# EAGLE design Gadget-Box-atmega32u4 (EAGLE 6.6.0)

## Sheet 1 of 3
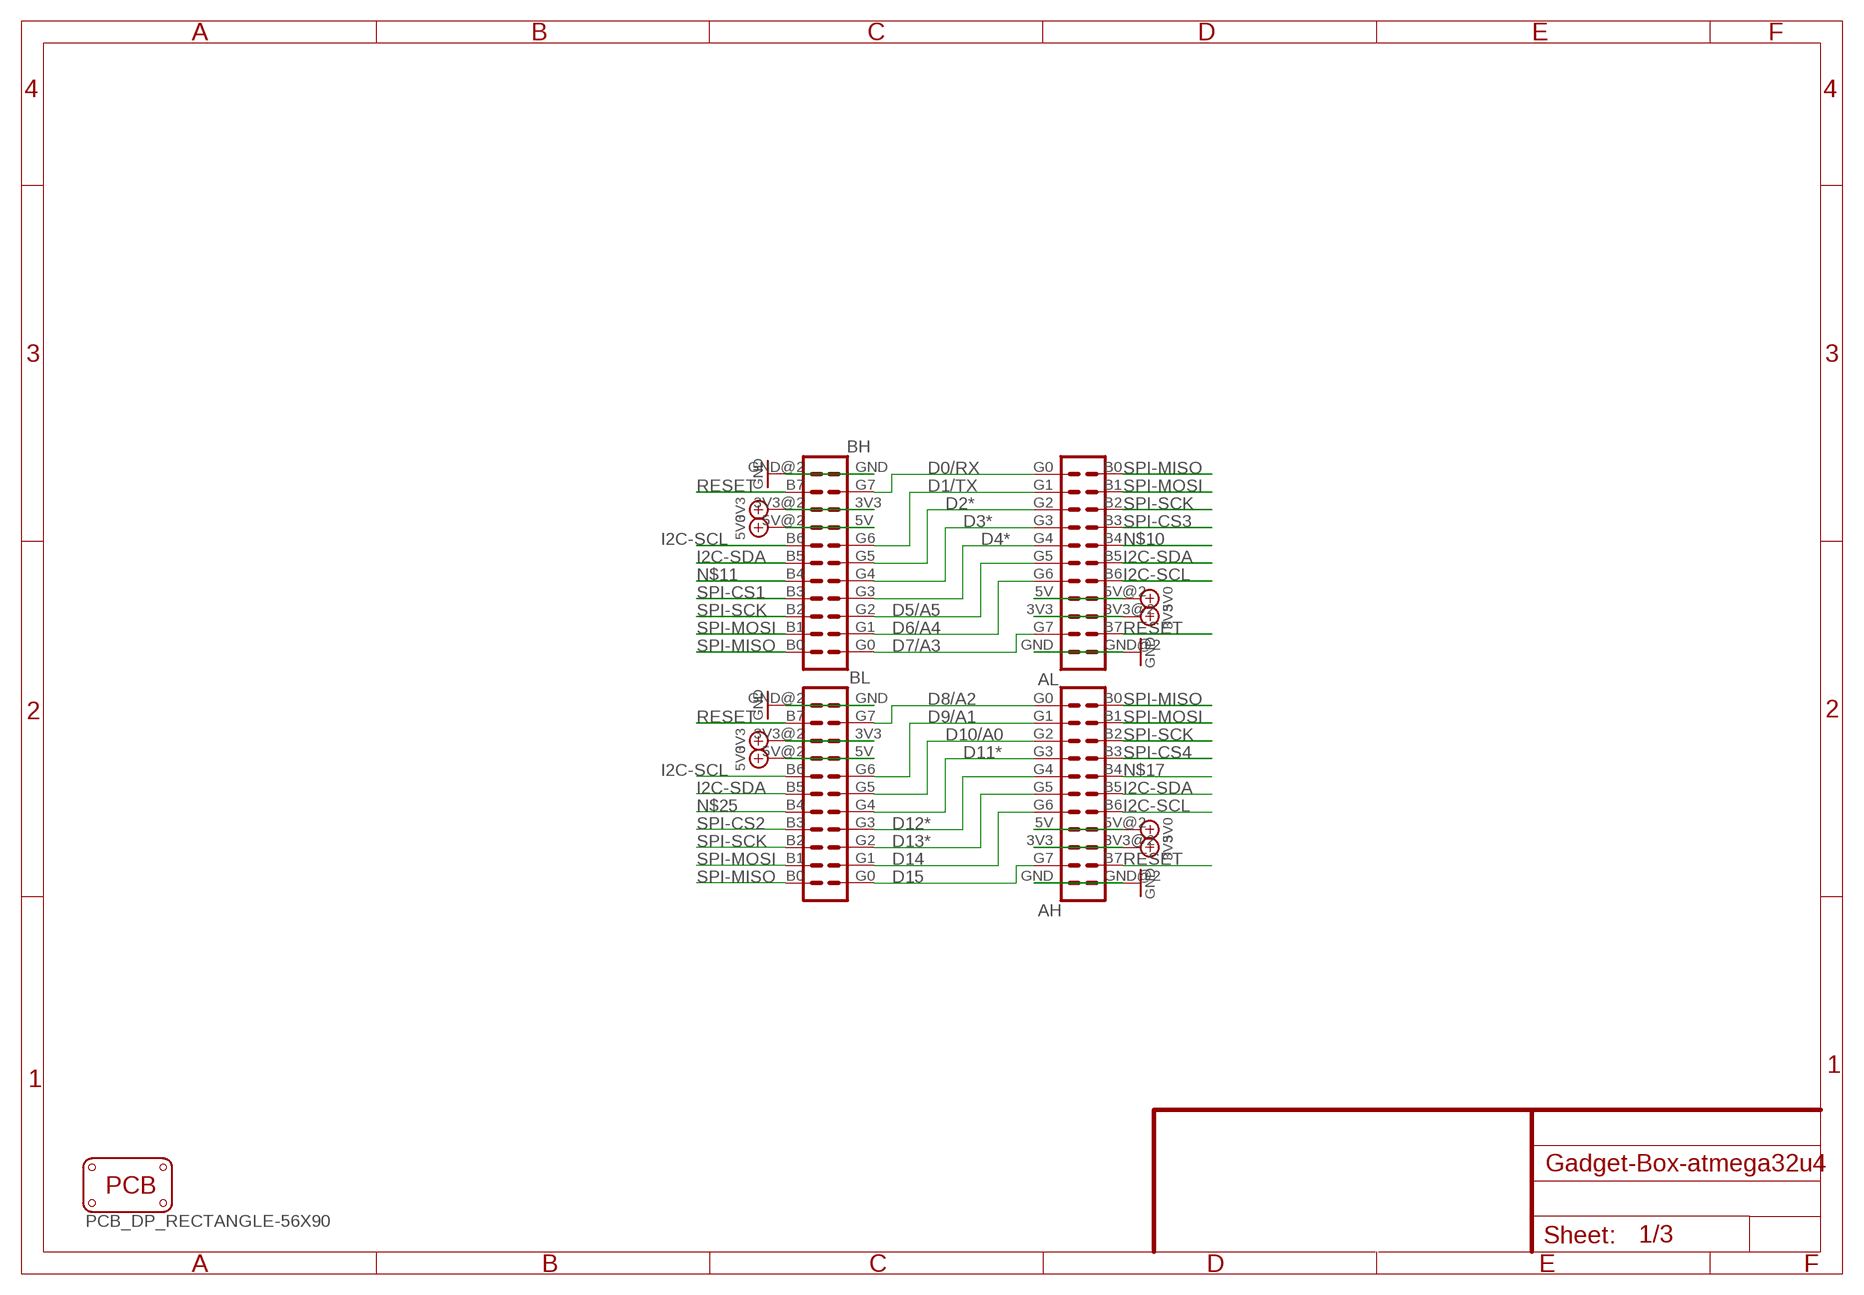
[diagram p0: schematic, sheet 1]

### Parts
AH  ECOGECOG_SLOT  [ECOG]
AL  ECOGECOG_SLOT  [ECOG]
BH  ECOGECOG_SLOT  [ECOG]
BL  ECOGECOG_SLOT  [ECOG]
PCB1  PCB_DP_RECTANGLE-56X90  [DP9056_V1]

### Nets
3V3: AH.3V3 AH.3V3@2(3V3) AL.3V3 AL.3V3@2(3V3) BH.3V3 BH.3V3@2(3V3) BL.3V3 BL.3V3@2(3V3) ; also sheet 2,3
5V0: AH.5V AH.5V@2(5V) AL.5V AL.5V@2(5V) BH.5V BH.5V@2(5V) BL.5V BL.5V@2(5V) ; also sheet 2,3
D0/RX: AL.G0 BH.G7 ; also sheet 2
D1/TX: AL.G1 BH.G6 ; also sheet 2
D2*: AL.G2 BH.G5 ; also sheet 2
D3*: AL.G3 BH.G4 ; also sheet 2
D4*: AL.G4 BH.G3 ; also sheet 2
D5/A5: AL.G5 BH.G2 ; also sheet 2
D6/A4: AL.G6 BH.G1 ; also sheet 2
D7/A3: AL.G7 BH.G0 ; also sheet 2
D8/A2: AH.G0 BL.G7 ; also sheet 2
D9/A1: AH.G1 BL.G6 ; also sheet 2
D10/A0: AH.G2 BL.G5 ; also sheet 2
D11*: AH.G3 BL.G4 ; also sheet 2
D12*: AH.G4 BL.G3 ; also sheet 2
D13*: AH.G5 BL.G2 ; also sheet 2
D14: AH.G6 BL.G1 ; also sheet 2
D15: AH.G7 BL.G0 ; also sheet 2
GND [gnd]: AH.GND AH.GND@2(GND) AL.GND AL.GND@2(GND) BH.GND BH.GND@2(GND) BL.GND BL.GND@2(GND) ; also sheet 2,3
I2C-SCL: AH.B6 AL.B6 BH.B6 BL.B6 ; also sheet 2
I2C-SDA: AH.B5 AL.B5 BH.B5 BL.B5 ; also sheet 2
N$10: AL.B4
N$11: BH.B4
N$17: AH.B4
N$25: BL.B4
RESET: AH.B7 AL.B7 BH.B7 BL.B7 ; also sheet 2
SPI-CS1: BH.B3 ; also sheet 2
SPI-CS2: BL.B3 ; also sheet 2
SPI-CS3: AL.B3 ; also sheet 2
SPI-CS4: AH.B3 ; also sheet 2
SPI-MISO: AH.B0 AL.B0 BH.B0 BL.B0 ; also sheet 2
SPI-MOSI: AH.B1 AL.B1 BH.B1 BL.B1 ; also sheet 2
SPI-SCK: AH.B2 AL.B2 BH.B2 BL.B2 ; also sheet 2

## Sheet 2 of 3
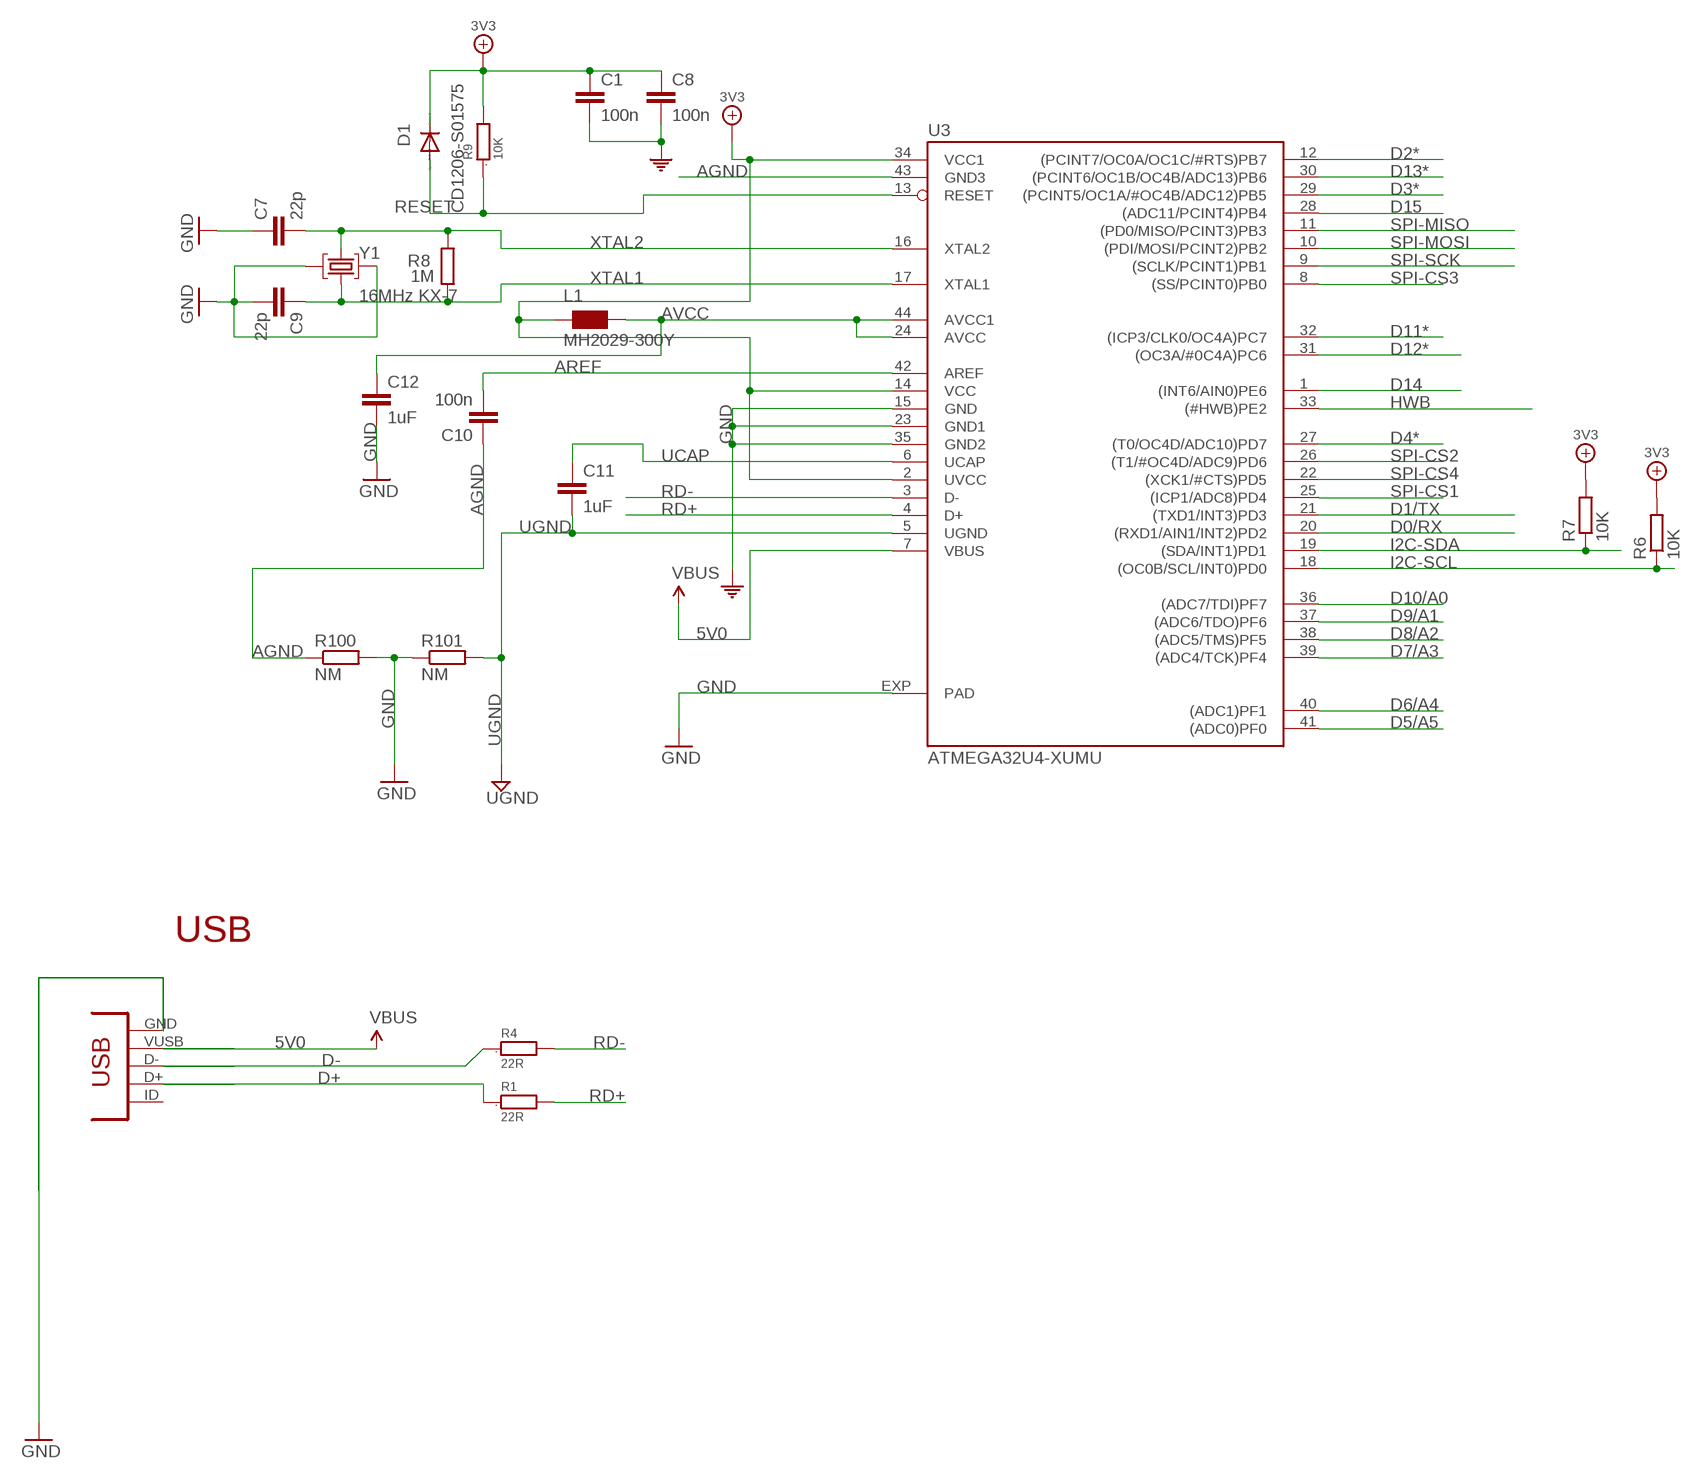
[diagram p1: schematic, sheet 2, part 1 of 2]
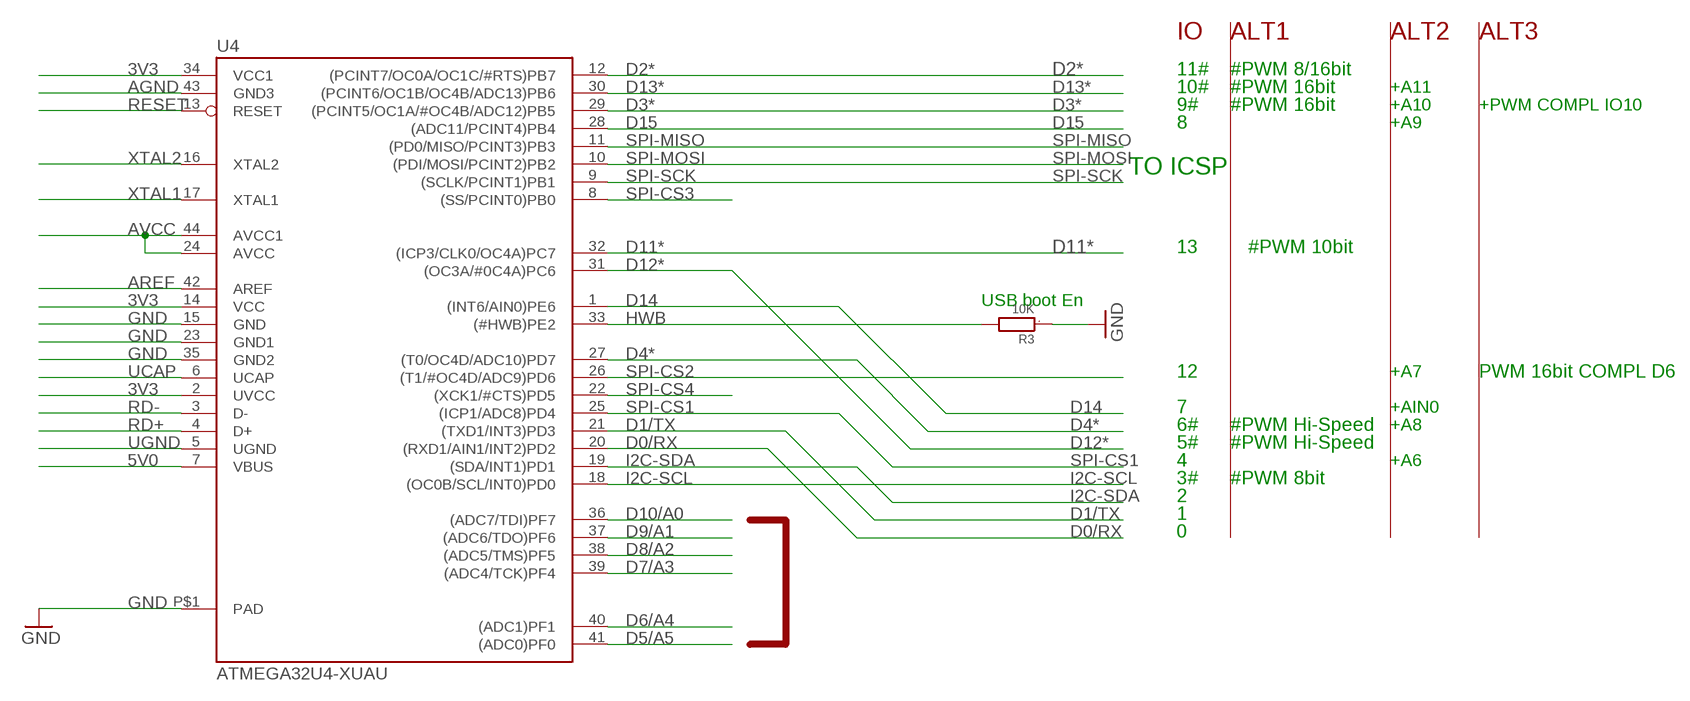
[diagram p2: schematic, sheet 2, part 2 of 2]

### Parts
C1  100n  C-EUC0603  [C0603-ROUND]
C7  22p  C-EUC0603  [C0603-ROUND]
C8  100n  C-EUC0603  [C0603-ROUND]
C9  22p  C-EUC0603  [C0603-ROUND]
C10  100n  C-EUC0603  [C0603-ROUND]
C11  1uF  C-EUC0603  [C0603-ROUND]
C12  1uF  C-EUC0603  [C0603-ROUND]
D1  CD1206-S01575  DIODE-MINIMELF  [MINIMELF]
L1  MH2029-300Y  WE-CBF_0805  [0805]
R1  22R  R0805  [0805]
R3  10K  R0805  [0805]
R4  22R  R0805  [0805]
R6  10K  R-EU_R0402  [R0402]
R7  10K  R-EU_R0402  [R0402]
R8  1M  R-EU_R0603  [R0603-ROUND]
R9  10K  R0805  [0805]
R100  NM  R-EU_R0402  [R0402]
R101  NM  R-EU_R0402  [R0402]
U3  ATMEGA32U4-XUMU  [QFN44ML7X7]
U4  ATMEGA32U4-XUAU  [TQFP44-PAD]
USB  CONN_USB  [CONN_USB_MINI-B]
Y1  16MHz KX-7  CRYSTAL-3.2-2.5  [CRYSTAL-3.2-2.5]

### Nets
3V3: C1.1 C8.1 D1.C L1.1 R6.2 R7.2 R9.2 U3.2(UVCC) U3.14(VCC) U3.34(VCC1) U4.2(UVCC) U4.14(VCC) U4.34(VCC1) ; also sheet 1,3
5V0: U3.7(VBUS) U4.7(VBUS) USB.VUSB ; supply symbol labelled VBUS ; also sheet 1,3
AGND: C10.1 R100.1 U3.43(GND3) U4.43(GND3)
AREF [aref]: C10.2 U3.42(AREF) U4.42(AREF)
AVCC: C12.1 L1.2 U3.24(AVCC) U3.44(AVCC1) U4.24(AVCC) U4.44(AVCC1)
D0/RX: U3.20((RXD1/AIN1/INT2)PD2) U4.20((RXD1/AIN1/INT2)PD2) ; also sheet 1
D1/TX: U3.21((TXD1/INT3)PD3) U4.21((TXD1/INT3)PD3) ; also sheet 1
D2*: U3.12((PCINT7/OC0A/OC1C/#RTS)PB7) U4.12((PCINT7/OC0A/OC1C/#RTS)PB7) ; also sheet 1
D3*: U3.29((PCINT5/OC1A/#OC4B/ADC12)PB5) U4.29((PCINT5/OC1A/#OC4B/ADC12)PB5) ; also sheet 1
D4*: U3.27((T0/OC4D/ADC10)PD7) U4.27((T0/OC4D/ADC10)PD7) ; also sheet 1
D5/A5: U3.41((ADC0)PF0) U4.41((ADC0)PF0) ; also sheet 1
D6/A4: U3.40((ADC1)PF1) U4.40((ADC1)PF1) ; also sheet 1
D7/A3: U3.39((ADC4/TCK)PF4) U4.39((ADC4/TCK)PF4) ; also sheet 1
D8/A2: U3.38((ADC5/TMS)PF5) U4.38((ADC5/TMS)PF5) ; also sheet 1
D9/A1: U3.37((ADC6/TDO)PF6) U4.37((ADC6/TDO)PF6) ; also sheet 1
D10/A0: U3.36((ADC7/TDI)PF7) U4.36((ADC7/TDI)PF7) ; also sheet 1
D11*: U3.32((ICP3/CLK0/OC4A)PC7) U4.32((ICP3/CLK0/OC4A)PC7) ; also sheet 1
D12*: U3.31((OC3A/#0C4A)PC6) U4.31((OC3A/#0C4A)PC6) ; also sheet 1
D13*: U3.30((PCINT6/OC1B/OC4B/ADC13)PB6) U4.30((PCINT6/OC1B/OC4B/ADC13)PB6) ; also sheet 1
D14: U3.1((INT6/AIN0)PE6) U4.1((INT6/AIN0)PE6) ; also sheet 1
D15: U3.28((ADC11/PCINT4)PB4) U4.28((ADC11/PCINT4)PB4) ; also sheet 1
D+: R1.1 USB.D+
D-: R4.1 USB.D-
GND [gnd]: C1.2 C7.1 C8.2 C9.2 C12.2 R3.1 R100.2 R101.1 U3.15(GND) U3.23(GND1) U3.35(GND2) U3.EXP(PAD) U4.15(GND) U4.23(GND1) U4.35(GND2) U4.P$1(PAD) USB.GND Y1.2(GND) Y1.4(GND) ; supply symbol labelled COM ; also sheet 1,3
HWB: R3.2 U3.33((#HWB)PE2) U4.33((#HWB)PE2)
I2C-SCL: R6.1 U3.18((OC0B/SCL/INT0)PD0) U4.18((OC0B/SCL/INT0)PD0) ; also sheet 1
I2C-SDA: R7.1 U3.19((SDA/INT1)PD1) U4.19((SDA/INT1)PD1) ; also sheet 1
RD+: R1.2 U3.4(D+) U4.4(D+)
RD-: R4.2 U3.3(D-) U4.3(D-)
RESET: D1.A R9.1 U3.13(RESET) U4.13(RESET) ; also sheet 1
SPI-CS1: U3.25((ICP1/ADC8)PD4) U4.25((ICP1/ADC8)PD4) ; also sheet 1
SPI-CS2: U3.26((T1/#OC4D/ADC9)PD6) U4.26((T1/#OC4D/ADC9)PD6) ; also sheet 1
SPI-CS3: U3.8((SS/PCINT0)PB0) U4.8((SS/PCINT0)PB0) ; also sheet 1
SPI-CS4: U3.22((XCK1/#CTS)PD5) U4.22((XCK1/#CTS)PD5) ; also sheet 1
SPI-MISO: U3.11((PD0/MISO/PCINT3)PB3) U4.11((PD0/MISO/PCINT3)PB3) ; also sheet 1
SPI-MOSI: U3.10((PDI/MOSI/PCINT2)PB2) U4.10((PDI/MOSI/PCINT2)PB2) ; also sheet 1
SPI-SCK: U3.9((SCLK/PCINT1)PB1) U4.9((SCLK/PCINT1)PB1) ; also sheet 1
UCAP: C11.1 U3.6(UCAP) U4.6(UCAP)
UGND [gnd]: C11.2 R101.2 U3.5(UGND) U4.5(UGND)
XTAL1: C9.1 R8.1 U3.17(XTAL1) U4.17(XTAL1) Y1.1(C1)
XTAL2: C7.2 R8.2 U3.16(XTAL2) U4.16(XTAL2) Y1.3(C2)
Unconnected: USB.BODY@1(BODY) USB.BODY@2(BODY) USB.BODY@3(BODY) USB.BODY@4(BODY) USB.ID(USBID)

### Notes on the sheet
- IO | ALT1 | ALT2 | ALT3
- 11# | #PWM 8/16bit
- 10# | #PWM 16bit | +A11
- 9# | #PWM 16bit | +A10 | +PWM COMPL IO10
- 8 | +A9
- TO ICSP
- 13 | #PWM 10bit
- USB boot En
- 12 | +A7 | PWM 16bit COMPL D6
- 7 | +AIN0
- 6# | #PWM Hi-Speed | +A8
- 5# | #PWM Hi-Speed
- 4 | +A6
- 3# | #PWM 8bit
- 2
- 1
- 0
- USB

## Sheet 3 of 3
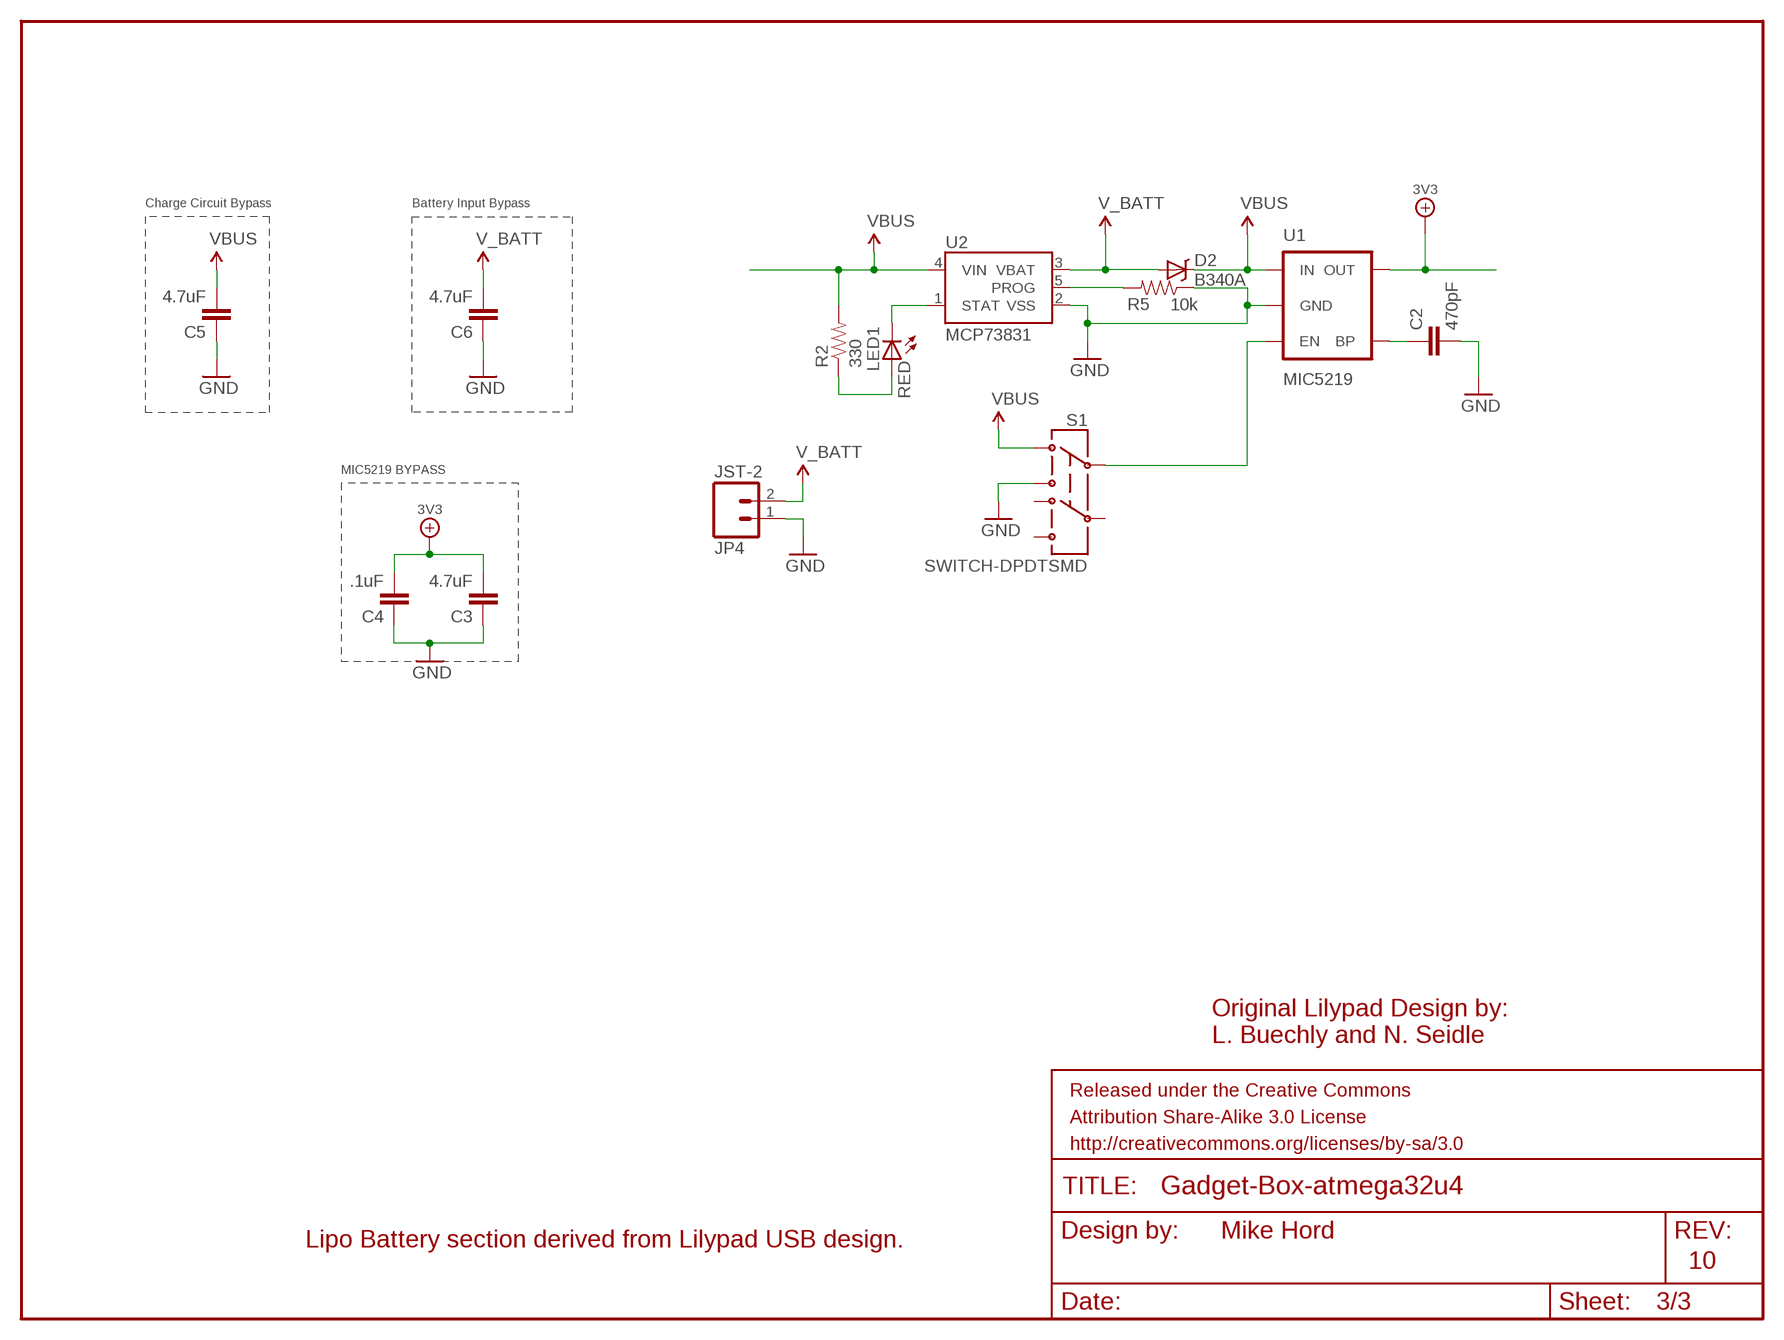
[diagram p3: schematic, sheet 3]

### Parts
C2  470pF  CAP0603-CAP  [0603-CAP]
C3  4.7uF  CAP0603-CAP  [0603-CAP]
C4  .1uF  CAP0603-CAP  [0603-CAP]
C5  4.7uF  CAP1206  [1206]
C6  4.7uF  CAP1206  [1206]
D2  B340A  DIODE-SCHOTTKY_  [SMA-DIODE]
JP4  JST-2  M02-JST-2MM-SMT  [JST-2-SMD]
LED1  RED  LED0603  [LED-0603]
R2  330  RESISTOR0603-RES  [0603-RES]
R5  10k  RESISTOR0603-RES  [0603-RES]
S1  SWITCH-DPDTSMD  [AYZ0202]
U1  MIC5219  V_REG_MIC5219SMD  [SOT23-5]
U2  MCP73831  [SOT23-5]

### Nets
3V3: C3.2 C4.2 U1.5(OUT) ; also sheet 1,2
5V0: C5.2 D2.C R2.2 S1.1 U1.1(IN) U2.4(VIN) ; supply symbol labelled VBUS ; also sheet 1,2
GND [gnd]: C2.2 C3.1 C4.1 C5.1 C6.1 JP4.1 R5.1 S1.3 U1.2(GND) U2.2(VSS) ; also sheet 1,2
N$1: S1.2 U1.3(EN)
N$4: LED1.A R2.1
N$5: LED1.C U2.1(STAT)
N$6: R5.2 U2.5(PROG)
N$8: C2.1 U1.4(BP)
V_BATT: C6.2 D2.A JP4.2 U2.3(VBAT)
Unconnected: S1.4 S1.5 S1.6

### Notes on the sheet
- Charge Circuit Bypass | Battery Input Bypass
- MIC5219 BYPASS
- Original Lilypad Design by:
- L. Buechly and N. Seidle
- Mike Hord
- Lipo Battery section derived from Lilypad USB design.
- 10

## Library data of the parts
AH AL BH BL = eCogs:ECOG
C1 C7-C12 = SmartPrj:C-EU: CAPACITOR, European symbol
C2 = SparkFun-Passives:CAP: Capacitor Standard 0603 ceramic capacitor, and 0.1" leaded capacitor.; PROD_ID: CAP-07884
C3 = SparkFun-Passives:CAP: Capacitor Standard 0603 ceramic capacitor, and 0.1" leaded capacitor.; PROD_ID: CAP-08280
C4 = SparkFun-Passives:CAP: Capacitor Standard 0603 ceramic capacitor, and 0.1" leaded capacitor.; PROD_ID: CAP-00810
C5 C6 = SparkFun-Passives:CAP: Capacitor Standard 0603 ceramic capacitor, and 0.1" leaded capacitor.; PROD_ID: CAP-10300
D1 = diode:DIODE-: DIODE
D2 = SparkFun-DiscreteSemi:DIODE-SCHOTTKY: Commonly MBRA140.; PROD_ID: DIO-09886
JP4 = SparkFun-Connectors:M02: Header 2 Standard 2-pin 0.1" header. Use with straight break away headers (SKU : PRT-00116), right angle break away headers (PRT-00553), swiss pins (PRT-00743), machine pins (PRT-00117), and female headers (PRT-00115). Molex polarized connector foot print use with SKU : PRT-08233 with associated crimp pins and housings.; PROD_ID: CONN-08352
L1 = wuerth-elektronik:WE-CBF: SMD EMI Suppression Ferrite Beads - excellent anti-EMI properties - low DCR - impedances till 3000 ohms - rated current up to 6 A
LED1 = SparkFun-LED:LED: LEDs Standard schematic elements and footprints for 5mm, 3mm, 1206, and 0603 sized LEDs. 5mm - Spark Fun Electronics SKU : COM-00529 (and others); PROD_ID: DIO-00819
PCB1 = dp_pcb:PCB_DP_RECTANGLE: Dangerous Prototypes Standard Rectangular PCB sizes
R1 R3 R4 R9 = GadgetFactory_6.0:R: RESISTOR, European symbol
R2 = SparkFun-Passives:RESISTOR: Resistor Basic schematic elements and footprints for 0603, 1206, and PTH resistors.; PROD_ID: RES-00818
R5 = SparkFun-Passives:RESISTOR: Resistor Basic schematic elements and footprints for 0603, 1206, and PTH resistors.; PROD_ID: RES-00824
R6-R8 R100 R101 = SmartPrj:R-EU_: RESISTOR, European symbol
S1 = SparkFun-Electromechanical:SWITCH-DPDT: DPDT Version of the COM-00597; PROD_ID: SWCH-08179
U1 = SparkFun-PowerIC:V_REG_MIC5219: V_REG MIC5219 Standard 500mA LDO voltage regulator in SOT-23 layout. Micrel part MIC5219. BP (by-pass) pin is used to lower output noise with 470pF cap, may be left open.; PROD_ID: VREG-09872
U2 = SparkFun-PowerIC:MCP73831: Miniature single cell, fully integrated Li-Ion, Li-polymer charge management controller http://ww1.microchip.com/downloads/en/DeviceDoc/21984a.pdf; PROD_ID: IC-09995
U3 U4 = SmartPrj:ATMEGA32U4-XU
USB = dp_devices:CONN_USB: USB connector
Y1 = SmartPrj:CRYSTAL-3.2-2.5

## Net classes
0 default: width 0.254 mm, drill 0.381 mm, clearance 0.254 mm
2 gnd: width 0.254 mm, drill 0.381 mm, clearance 0.254 mm
3 usbvcc: width 0.254 mm, drill 0.381 mm, clearance 0.254 mm
4 aref: width 0.254 mm, drill 0.381 mm, clearance 0.254 mm

## Board
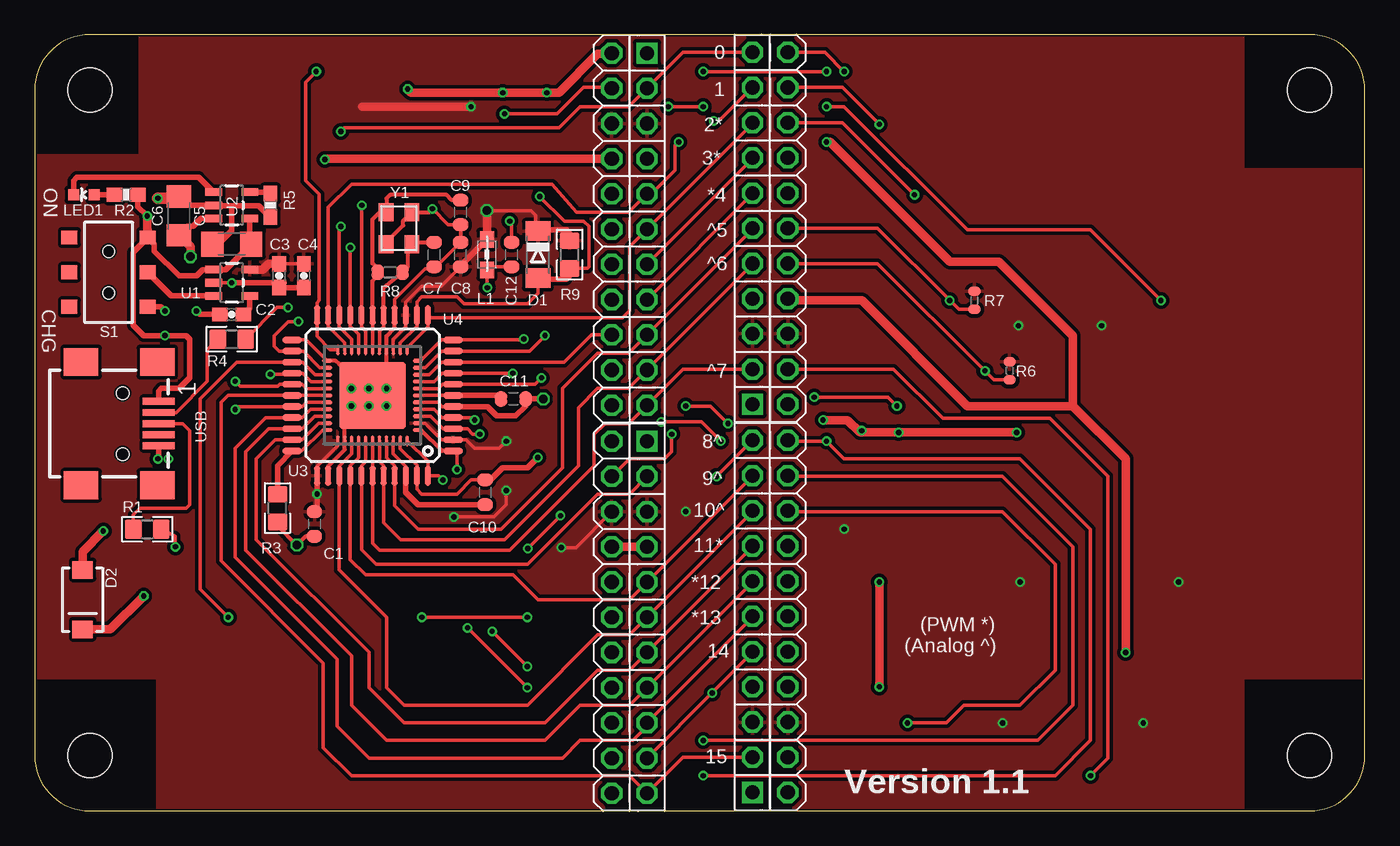
[diagram p4: board, top side]
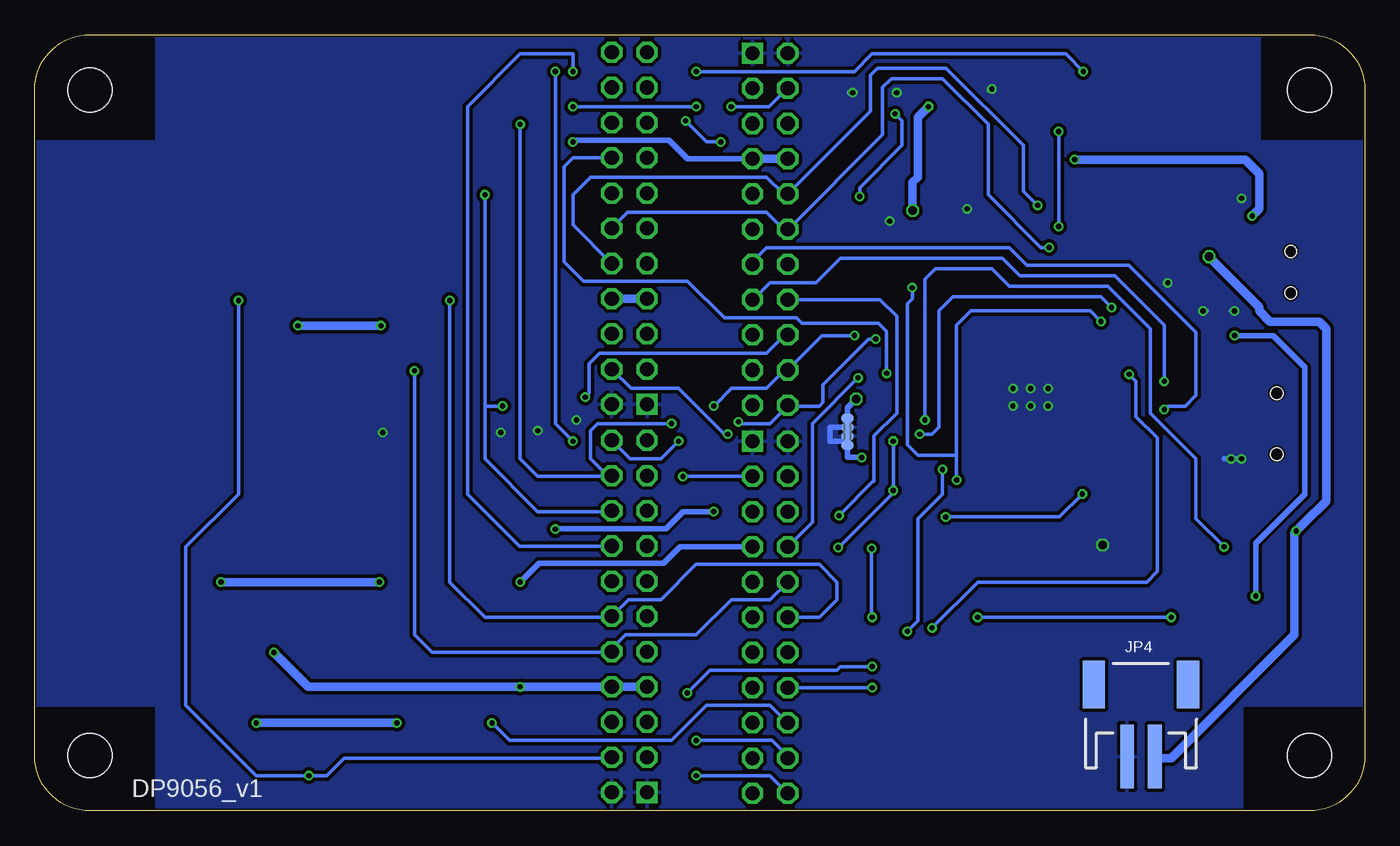
[diagram p5: board, bottom side, seen from below]

Size 96 x 56 mm. Coordinates in mm from the lower left corner, seen from the top.
Copper layers (1*16): Top 0.035mm / dielectric 1.5mm / Bottom 0.035mm
Design rules "hackvana *": minimum track width 6mil, minimum drill 0.3mm, track to track 6mil, track to pad 6mil, pad to pad 6mil, via to via 6mil, smd to smd 0mil, copper to edge 6mil, drill to drill 6mil, minimum pad ring 10mil, minimum via ring 6mil, stop-mask expansion 2mil, vias tented up to drill 100mil, thermal gap 10mil

### Footprints (pad centres in the part's own frame; a part is rotated, then mirrored left to right if it is on the bottom)
ECOG = drill 1.016 octagon: 3V3 21.59,1.27; 3V3@2 21.59,3.81; 5V 19.05,1.27; 5V@2 19.05,3.81; B0 1.27,3.81; B1 3.81,3.81; B2 6.35,3.81; B3 8.89,3.81; B4 11.43,3.81; B5 13.97,3.81; B6 16.51,3.81; B7 24.13,3.81; G0 1.27,1.27; G1 3.81,1.27; G2 6.35,1.27; G3 8.89,1.27; G4 11.43,1.27; G5 13.97,1.27; G6 16.51,1.27; G7 24.13,1.27; GND@2 26.67,3.81 | drill 1.016 square: GND 26.67,1.27
C0603-ROUND = smd 0.898 x 1.1: 1 -0.889,0; 2 0.889,0
0603-CAP = smd 1.1 x 1: 1 -0.85,0; 2 0.85,0
1206 = smd 1.6 x 1.8: 1 -1.4,0; 2 1.4,0
MINIMELF = smd 1.4 x 1.8: A 1.7,0; C -1.7,0
SMA-DIODE = smd 1.27 x 1.47: A -2.15,0; C 2.15,0
JST-2-SMD = smd 1 x 4.6: 1 -1,-3.7; 2 1,-3.7 | smd 1.6 x 3.4: NC1 -3.4,1.5; NC2 3.4,1.5
0805 = smd 1.2 x 1: 1 -1.1,0; 2 1.1,0
LED-0603 = smd 0.8 x 0.8: A 0,-0.75; C 0,0.75
DP9056_V1 = hole 3.2: 4,4; 92,4; 92,52; 4,52
0805' = smd 1.2 x 1.4: 1 -1,0; 2 1,0
0603-RES = smd 1.1 x 1: 1 -0.85,0; 2 0.85,0
R0402 = smd 0.7 x 0.9: 1 -0.65,0; 2 0.65,0
R0603-ROUND = smd 0.898 x 1.1: 1 -0.889,0; 2 0.889,0
AYZ0202 = smd 1 x 1.15: 1 -2.5,2.825; 2 0,2.825; 3 2.5,2.825; 4 -2.5,-2.825; 5 0,-2.825; 6 2.5,-2.825 | hole 0.85: 1.5,0; -1.5,0
SOT23-5 = smd 0.55 x 1.2: 1 -0.95,-1.3; 2 0,-1.3; 3 0.95,-1.3; 4 0.95,1.3; 5 -0.95,1.3
QFN44ML7X7 = smd 0.75 x 0.275: 1 -3.275,2.5; 2 -3.275,2; 3 -3.275,1.5; 4 -3.275,1; 5 -3.275,0.5; 6 -3.275,0; 7 -3.275,-0.5; 8 -3.275,-1; 9 -3.275,-1.5; 10 -3.275,-2; 11 -3.275,-2.5; 23 3.275,-2.5; 24 3.275,-2; 25 3.275,-1.5; 26 3.275,-1; 27 3.275,-0.5; 28 3.275,0; 29 3.275,0.5; 30 3.275,1; 31 3.275,1.5; 32 3.275,2; 33 3.275,2.5 | smd 0.275 x 0.75: 12 -2.5,-3.275; 13 -2,-3.275; 14 -1.5,-3.275; 15 -1,-3.275; 16 -0.5,-3.275; 17 0,-3.275; 18 0.5,-3.275; 19 1,-3.275; 20 1.5,-3.275; 21 2,-3.275; 22 2.5,-3.275; 34 2.5,3.275; 35 2,3.275; 36 1.5,3.275; 37 1,3.275; 38 0.5,3.275; 39 0,3.275; 40 -0.5,3.275; 41 -1,3.275; 42 -1.5,3.275; 43 -2,3.275; 44 -2.5,3.275 | smd 4.826 x 4.826: EXP 0,0
TQFP44-PAD = smd 1.4 x 0.45: 1 -5.8,4; 2 -5.8,3.2; 3 -5.8,2.4; 4 -5.8,1.6; 5 -5.8,0.8; 6 -5.8,0; 7 -5.8,-0.8; 8 -5.8,-1.6; 9 -5.8,-2.4; 10 -5.8,-3.2; 11 -5.8,-4; 23 5.8,-4; 24 5.8,-3.2; 25 5.8,-2.4; 26 5.8,-1.6; 27 5.8,-0.8; 28 5.8,0; 29 5.8,0.8; 30 5.8,1.6; 31 5.8,2.4; 32 5.8,3.2; 33 5.8,4 | smd 0.45 x 1.4: 12 -4,-5.8; 13 -3.2,-5.8; 14 -2.4,-5.8; 15 -1.6,-5.8; 16 -0.8,-5.8; 17 0,-5.8; 18 0.8,-5.8; 19 1.6,-5.8; 20 2.4,-5.8; 21 3.2,-5.8; 22 4,-5.8; 34 4,5.8; 35 3.2,5.8; 36 2.4,5.8; 37 1.6,5.8; 38 0.8,5.8; 39 0,5.8; 40 -0.8,5.8; 41 -1.6,5.8; 42 -2.4,5.8; 43 -3.2,5.8; 44 -4,5.8 | smd 1 x 1: P$1 0,0
CONN_USB_MINI-B = smd 2 x 2.5: BODY@1 -4.45,2.5; BODY@2 4.45,2.5; BODY@3 4.45,-3; BODY@4 -4.45,-3 | smd 0.5 x 2.3: D+ 0,2.6; D- -0.8,2.6; GND 1.6,2.6; ID 0.8,2.6; VUSB -1.6,2.6 | hole 0.9: -2.2,0; 2.2,0
CRYSTAL-3.2-2.5 = smd 1.3 x 1.05: 1 -1.15,-0.925; 2 1.15,-0.925; 3 1.15,0.925; 4 -1.15,0.925

### Placement (x,y rotation side)
AH  50.54,28 270 top
AL  50.54,56 270 top
BH  45.46,28 90 top
BL  45.46,0 90 top
C1  20.19,20.7 270 top
C2  14.22,35.81 180 top
C3  17.65,38.61 90 top
C4  19.43,38.61 90 top
C5  14.22,40.89 0 top
C6  10.41,42.93 270 top
C7  28.83,40.13 90 top
C8  30.73,40.13 90 top
C9  30.73,43.18 270 top
C10  32.51,22.99 270 top
C11  34.54,29.72 0 top
C12  34.42,40.13 90 top
D1  36.32,40.13 270 top
D2  3.46,15.24 270 top
JP4  16.16,7.62 0 bottom
L1  32.64,40.13 270 top
LED1  3.56,44.45 90 top
PCB1  0,0 0 top
R1  22R  [0805']  8.13,20.32 0 top
R2  6.6,44.45 0 top
R3  10K  [0805']  17.53,21.84 90 top
R4  22R  [0805']  14.22,34.04 0 top
R5  17.02,43.69 90 top
R6  70.36,31.75 90 top
R7  67.82,36.83 90 top
R8  25.65,38.86 0 top
R9  10K  [0805']  38.61,40.13 90 top
R100  37.34,27.03 90 bottom
R101  37.34,27.66 90 bottom
S1  5.33,38.86 270 top
U1  14.22,38.1 270 top
U2  14.22,43.69 270 top
U3  24.38,29.97 180 top
U4  24.38,29.97 180 top
USB  6.35,27.94 270 top
Y1  26.29,42.04 270 top

### Tracks (layer width: path | path; a pad name or v marks a point on that pad's centre or on a via)
3V3  (via drill 0.38, 0.61)
  Top 0.254: U4.34 20.38,24.85 21.88,26.35 | U3.2 28.16,27.97 29.36,26.77 U4.2 31.14,26.77 31.75,26.16 33.53,26.16 v34.04,26.67 | U3.14 25.88,34.01 26.78,34.91 U4.14 26.78,36.69 27.94,37.85 29.34,37.85 C8.1 | C3.2 C4.2 | v34.04,23.11 34.04,22.07 33.17,21.21 v30.25,21.21 | 36.15,41.96 36.15,42.98 35.81,43.31 v32.64,43.31 | v38,19 39.06,19 BL.3V3@2
  Top 0.406: L1.1 30.89,39.48 30.89,39.4 C8.1 | 36.15,41.96 36.2,41.91 36.24,41.91 D1.C 36.4,41.91 38.35,41.91 38.61,41.66 R9.2 | U4.34 v20.38,22.86 20.38,21.78 C1.1
  Top 0.61: v32.64,43.31 L1.1 | v31.5,50.8 23.62,50.8 | U1.5 16.47,39.05 16.88,39.46 C3.2
  Bottom 0.254: v34.04,26.67 v34.04,23.11 34.04,22.96 v38,19 | v30.25,21.21 22.04,21.21 v20.38,22.86
  Bottom 0.406: v46.99,21.59 49.23,21.59 50.44,20.37 58.37,20.37 v58.42,20.32
  Bottom 0.61: v32.64,43.31 32.64,45.34 32.26,45.72 32.26,50.04 v31.5,50.8 | v71,35 v77,35 | v69.85,6.35 v80.01,6.35 | v82.55,16.51 v71.12,16.51
  pour Top: 0,9.62 0,47.26 7.62,47.26 7.62,55.88 87.2,55.88 87.2,46.26 96.17,46.26 96.17,9.62 87.2,9.62 87.2,0 8.89,0 8.89,9.62
5V0  (via drill 0.38)
  Top 0.254: U3.7 29.13,30.47 29.43,30.77 U4.7 36.11,30.77 v36.58,31.24
  Top 0.406: USB.VUSB 8.95,30.29 9.14,30.48 10.41,30.48 11.18,31.24 11.18,34.04 10.92,34.29 v9.4,34.29 7.87,34.29 7.11,35.05 7.11,40.31 S1.1 | S1.1 8.16,41.91 8.16,42.9 v8.13,42.93 7.45,43.6 R2.2 | S1.1 8.64,40.88 8.64,40.39 10.41,38.61 11.68,38.61 12.13,39.05 U1.1 13.78,39.05 C5.2 15.52,40.99 U2.4
  Top 0.61: D2.C 5.47,13.09 v7.87,15.49 | v57.15,48.26 57.4,48.26 66.04,39.62 69.6,39.62 74.93,34.29 74.93,29.21 | 74.93,29.21 67.31,29.21 59.69,36.83 54.47,36.83 AL.5V@2 | v78.74,11.43 78.74,25.4 74.93,29.21 | BL.5V@2 BL.5V | BH.5V@2 21.02,47.05 v20.95,46.99 | v8.13,42.93 8.13,41.94 8.16,41.91 | v60.96,16.51 v60.96,8.95
  Bottom 0.254: v36.58,31.24 39.88,27.94 39.88,20.82 BL.5V@2
  Bottom 0.406: v9.4,34.29 6.6,34.29 4.32,32 4.32,22.86 7.87,19.3 v7.87,15.49 | BH.5V 48.88,47.05 50.22,48.39 57.02,48.39 v57.15,48.26 | BL.5V 49.43,19.05 50.62,17.86 59.61,17.86 v60.96,16.51
  Bottom 0.61: BH.5V@2 BH.5V | v78.74,11.43 76.26,8.95 v60.96,8.95 AH.5V@2 AH.5V | v8.13,42.93 7.62,43.43 7.62,45.97 8.64,46.99 v20.95,46.99 | AL.5V AL.5V@2
AGND  (via drill 0.38)
  Top 0.254: U3.43 26.38,26.12 27.58,24.92 U4.43 27.58,23.22 27.94,22.86 30.48,22.86 31.5,23.88 C10.1
  Top 0.406: C10.1 32.89,23.88 33.78,24.77 35.59,24.77 v36.32,25.5
  Bottom 0.406: R100.1 37.34,25.5 v36.32,25.5
AREF
  Top 0.254: U3.42 25.88,25.78 26.78,24.88 U4.42
  Top 0.406: U4.42 26.78,23 27.69,22.1 C10.2
AVCC  (via drill 0.38)
  Top 0.254: U3.44 26.9,26.7 28.38,25.21 U4.44 29.17,24.17 v29.46,23.88 | v19.05,35.31 18.29,35.31 17.27,34.29 17.27,33.53 17.63,33.17 U4.24 18.61,33.15 19.41,33.15 20.58,31.97 U3.24 | v32.66,37.74 32.64,37.77 L1.2 32.85,39.24 C12.1
  Bottom 0.254: v29.46,23.88 29.46,25.65 | 29.46,25.65 29.46,35.05 28.45,36.07 19.81,36.07 v19.05,35.31 | v32.66,37.74 32.66,36.93 33.02,36.58 33.02,26.42 32.26,25.65 29.46,25.65
D0/RX  (via drill 0.38)
  Top 0.254: U3.20 22.88,34.04 21.98,34.94 U4.20 21.98,42.05 v22.1,42.16 | v22.1,49.02 22.35,49.28 37.85,49.28 39.37,50.8 42.86,50.8 BH.G7 46.79,54.73 AL.G0
  Bottom 0.254: v22.1,49.02 v22.1,42.16
D1/TX  (via drill 0.38)
  Top 0.254: U3.21 22.38,33.77 21.18,34.98 U4.21 21.18,43.54 22.86,45.21 37.34,45.21 39.12,43.18 42.86,43.18 BH.G6 44.51,44.51 46.23,46.23 46.23,48.01 v46.48,48.26 | 51.81,52.13 AL.G1 49.4,49.78 v49.02,49.78
  Bottom 0.254: v46.48,48.26 47.5,48.26 v49.02,49.78
D2*
  Top 0.254: U3.12 26.88,33.41 28.38,34.91 U4.12 | 28.43,35.81 U4.12 | AL.G2 51.81,49.59 BH.G5 | BH.G5 44.19,41.9 | BH.G5 42.93,40.71 42.93,36.07 42.42,35.56 28.6,35.56 U4.12
D3*  (via drill 0.38)
  Top 0.254: U3.29 19.62,29.47 19.32,29.17 U4.29 14.69,29.17 v14.48,28.96 | AL.G3 51.81,47.05 BH.G4
  Bottom 0.254: v14.48,28.96 14.22,29.21 12.95,29.21 12.19,29.97 12.19,34.54 17.02,39.37 24.38,39.37 25.65,40.64 43.18,40.64 44.19,39.63 BH.G4
D4*  (via drill 0.38)
  Top 0.254: U3.27 19.62,30.47 19.32,30.77 U4.27 17.69,30.77 17.55,30.63 14.83,30.63 v14.48,30.99 14.69,30.77 | AL.G4 51.81,44.51 BH.G3
  Bottom 0.254: v14.48,30.99 14.48,35.05 18.03,38.61 24.89,38.61 26.16,39.88 37.85,39.88 39.62,38.1 42.93,38.1 44.14,36.89 BH.G3
D5/A5
  Top 0.254: U3.41 25.38,25.49 25.98,24.89 U4.41 25.98,22.02 27.69,20.32 33.66,20.32 38.1,24.77 38.1,30.48 40.64,33.02 42.86,33.02 BH.G2 51.81,41.97 AL.G5
D6/A4
  Top 0.254: U3.40 24.88,25.2 25.18,24.91 U4.40 25.18,20.79 26.42,19.56 33.91,19.56 39.24,24.89 39.24,29.08 40.64,30.48 42.86,30.48 BH.G1 51.81,39.43 AL.G6
D7/A3
  Top 0.254: U3.39 U4.39 24.38,19.3 24.89,18.8 34.29,18.8 40.39,24.89 40.39,27.18 41.15,27.94 42.86,27.94 BH.G0 46.79,31.87 AL.G7
D8/A2  (via drill 0.38)
  Top 0.254: U3.38 23.88,25.2 23.58,24.91 U4.38 23.58,18.83 24.64,17.78 35.56,17.78 40.64,22.86 42.92,22.86 BL.G7 | v49.21,24.13 AH.G0
  Bottom 0.254: v49.21,24.13 BL.G7
D9/A1
  Top 0.254: U3.37 23.38,25.49 22.78,24.89 U4.37 22.78,18.11 23.88,17.02 34.54,17.02 36.32,15.24 42.93,15.24 BL.G6 51.81,24.13 AH.G1
D10/A0
  Top 0.254: U3.36 22.88,25.78 21.98,24.88 U4.36 21.98,17.39 25.4,13.97 25.4,8.89 26.67,7.62 35.56,7.62 40.64,12.7 42.93,12.7 BL.G5 51.81,21.59 AH.G2
D11*
  Top 0.254: U3.32 20.5,27.97 19.3,26.77 U4.32 17.37,26.77 16,25.4 16,19.56 24.13,11.43 24.13,8.89 26.67,6.35 36.83,6.35 40.64,10.16 42.93,10.16 BL.G4 51.81,19.05 AH.G3
D12*
  Top 0.254: U3.31 20.22,28.47 19.32,27.57 U4.31 16.9,27.57 15.24,25.91 15.24,18.8 22.86,11.18 22.86,7.62 25.4,5.08 36.83,5.08 39.37,7.62 42.93,7.62 BL.G3 51.81,16.51 AH.G4
D13*
  Top 0.254: U3.30 19.9,28.97 19.3,28.37 U4.30 16.69,28.37 14.48,26.16 14.48,18.29 21.84,10.92 21.84,6.1 24.13,3.81 38.1,3.81 39.37,5.08 43.18,5.08 44.19,6.09 BL.G2 51.81,13.97 AH.G5
D14  (via drill 0.38)
  Top 0.254: v30.48,24.64 30.48,25.68 U4.1 | AH.G6 51.81,11.43 v48.89,8.51 BL.G1 | v33.02,12.95 v35.56,10.41
  Top 0.305: U3.1 27.9,27.47 29.4,25.97 U4.1
  Bottom 0.254: v48.89,8.51 47.24,10.16 38.1,10.16 37.85,10.41 v35.56,10.41 | v30.48,24.64 30.48,22.86 32.26,21.08 32.26,13.72 v33.02,12.95
D15
  Top 0.254: U3.28 U4.28 13.97,29.97 13.46,29.46 13.46,18.03 20.83,10.67 20.83,4.57 22.86,2.54 42.92,2.54 BL.G0 46.79,3.87 AH.G7
D+
  Top 0.254: R1.1 7.13,21.35 7.62,21.84 10.92,21.84 11.18,22.1 11.18,27.43 10.67,27.94 USB.D+
D-
  Top 0.254: USB.D- 10.2,28.74 12.45,30.99 12.45,33.26 R4.1
GND  (via drill 0.38, 0.61)
  Top 0.254: U3.23 19.61,33.97 U4.23 | U4.15 25.98,36.91 28.19,39.12 28.7,39.12 C7.1 28.96,39.24 C8.2 | U1.2 v14.22,38.1 | C9.2 29.84,42.29 v28.7,43.43 | C12.2 34.42,42.42 v34.29,42.55 | v25.4,30.48 25.4,30.6 25.21,30.79
  Top 0.279: U4.15 25.98,34.85 25.38,34.25 U3.15 25.38,30.97 | 22.38,27.97 U3.35 22.38,26.07 21.18,24.87 U4.35 | 21.73,32.47 U3.23
  Top 0.305: U4.P$1 25.21,30.79 25.38,30.97 | 22.38,27.97 U4.P$1 | 21.73,32.47 22,32.21 22.15,32.21 U4.P$1 | U4.P$1 26.29,28.07 | C1.2 19.56,19.81 v18.92,19.18 17.53,20.57 R3.1 | v28.7,43.43 28.45,43.19 Y1.4 26.59,42.57 26.59,42.24 25.36,41.01 Y1.2 | C9.2 C8.2
  Top 0.406: USB.GND 8.95,25.46 v8.89,25.4 | S1.3 9.1,36.36 v9.4,36.07 | C2.2 11.94,35.81 v11.68,36.07 | v14.22,38.1 18,38.1 C3.1 C4.1 | R5.1 16.98,42.84 16.15,43.66 14.22,43.66 | 14.22,43.66 12.95,43.66 U2.2 11.05,43.69 C6.1 | 14.22,43.66 14.22,41.86 13.51,41.15 13.08,41.15 C5.1
  Top 0.61: v26.92,52.07 27.18,51.82 v33.78,51.82 v36.96,51.82 | 37.08,51.82 37.85,51.82 40.64,54.61 41.59,54.61 BH.GND@2 | v70.87,27.3 v62.36,27.3 59.56,27.3 58.67,28.19 v56.9,28.19
  Top 0.813: v8.89,44.2 10.28,44.2 C6.1
  Bottom 0.254: v34.29,42.55 34.29,42.8
  Bottom 0.305: v28.7,43.43 28.96,43.43
  Bottom 0.406: v8.89,25.4 v9.65,25.4 10.16,25.4 | v9.4,36.07 9.65,36.07 | v11.68,36.07 11.43,36.07 | R101.1 R100.2 38.61,27.68 38.61,26.67 37.34,26.67 R101.1
  Bottom 0.61: v36.96,51.82 37.08,51.82
  other vias: 22.86,30.48 24.13,30.48 22.86,29.21 24.13,29.21 25.4,29.21 59.69,27.43
  pour Bottom: 0,7.62 0,48.26 7.62,48.26 7.62,56.39 87.2,56.39 87.2,48.26 96.17,48.26 96.17,7.62 87.2,7.62 87.2,-0.51 8.89,-0.51 8.89,7.62
HWB
  Top 0.254: U3.33 20.77,27.47 19.27,25.97 U4.33 18.52,25.91
  Top 0.406: R3.2 17.53,24.91 U4.33
I2C-SCL  (via drill 0.38)
  Top 0.254: U3.18 23.88,34.61 23.58,34.91 U4.18 23.58,43.65 v23.62,43.69 | AL.B6 60.84,39.49 v68.58,31.75 69.23,31.1 R6.1
  Bottom 0.254: v23.62,43.69 24.64,44.7 24.64,48.01 30.23,53.59 35.18,53.59 35.69,53.09 35.69,50.47 BH.B6 41.97,44.51 43.18,45.72 55.88,45.72 57.15,44.45 57.15,42.29 AL.B6 | BL.B6 42.92,15.24 45.72,15.24 48.26,12.7 53.34,12.7 54.35,11.69 AH.B6 54.41,11.43 67.31,11.43 68.58,12.7 v68.58,31.75
I2C-SDA  (via drill 0.38)
  Top 0.254: U3.19 23.38,34.38 22.78,34.98 U4.19 v22.78,40.64 | v22.78,40.64 | 54.49,42.03 AL.B5 60.84,42.03 v66.04,36.83 66.69,36.18 R7.1
  Bottom 0.254: v22.78,40.64 23.37,40.64 27.18,44.45 27.18,49.53 30.48,52.83 34.16,52.83 34.8,52.2 34.8,48.77 41.6,41.97 BH.B5 41.97,41.97 43.18,43.18 53.2,43.18 AL.B5 | v66.04,36.83 66.04,16.51 63.5,13.97 54.41,13.97 AH.B5 53.14,15.24 50.8,15.24 48.26,17.78 39.37,17.78 38.1,16.51 38.1,15.24 39.37,13.97 BL.B5
N$1
  Top 0.406: U1.3 9.87,37.15 S1.2
N$4
  Top 0.406: LED1.A R2.1
N$5
  Top 0.406: LED1.C 2.81,45.48 3.05,45.72 11.84,45.72 U2.1
N$6
  Top 0.406: U2.5 16.92,44.64 R5.2
N$8
  Top 0.406: U1.4 15.52,36.26 C2.1
RD+  (via drill 0.38)
  Top 0.254: U3.4 28.81,28.97 29.41,28.37 U4.4 31.57,28.37 v31.75,28.19 | v10.16,19.05 10.16,19.8 R1.2
  Bottom 0.254: v10.16,19.05 12.19,21.08 12.19,25.4 15.49,28.7 15.49,34.8 18.54,37.85 25.65,37.85 26.92,39.12 30.99,39.12 31.75,38.35 v31.75,28.19
RD-  (via drill 0.38)
  Top 0.254: U3.3 28.58,28.47 29.48,27.57 U4.3 31.23,27.57 31.62,27.18 v32.13,27.18 | v18.29,36.32 17.51,36.32 R4.2
  Bottom 0.254: v18.29,36.32 19.05,37.08 29.72,37.08 30.73,36.07 30.73,27.69 31.24,27.18 v32.13,27.18
RESET  (via drill 0.38)
  Top 0.254: U3.13 26.38,33.77 27.58,34.98 U4.13 27.58,36.73 27.94,37.08 30.48,37.08 30.99,36.58 35.56,36.58 36.32,37.34 D1.A | AL.B7 61.98,31.87 65.53,28.32 73.28,28.32 77.47,24.13 77.47,3.81 v76.2,2.54 | R9.1 39.89,39.13 40.01,39.24 40.01,42.16 39.62,42.55 38.23,42.55 v36.45,44.32 | v33.91,50.29 37.72,50.29 39.62,52.2 41.58,52.2 BH.B7 | v57.15,50.8 58.42,50.8 67.31,41.91 76.2,41.91 v81.28,36.83 | v45.72,50.8 v48.26,50.8 | BL.B7 42.93,25.4 45.47,25.4 45.97,25.91 v45.97,27.18
  Top 0.406: R9.1 38.61,38.61 38.35,38.35 36.4,38.35 D1.A
  Bottom 0.254: AH.B7 54.41,3.81 73.66,3.81 74.93,2.54 v76.2,2.54 80.01,2.54 85.09,7.62 85.09,19.05 81.28,22.86 v81.28,36.83 | AL.B7 52.96,30.48 49.53,30.48 46.23,27.18 v45.97,27.18 | v36.45,44.32 36.45,44.96 33.4,48.01 33.4,49.78 v33.91,50.29 | BH.B7 41.67,52.13 43,50.8 v45.72,50.8 | v48.26,50.8 v57.15,50.8
SPI-CS1  (via drill 0.38)
  Top 0.254: U3.25 20.24,31.47 19.34,32.37 U4.25 14.59,32.37 11.94,29.72 11.94,16 v13.97,13.97 | v35.56,13.97 v27.94,13.97 | v35.6,18.92 35.6,18.95 v37.95,21.3
  Bottom 0.254: BH.B3 34.98,36.89 33.78,35.69 33.78,28.7 35.43,27.05 35.43,23.77 35.48,23.77 v37.95,21.3 | 35.43,14.1 v35.56,13.97 35.6,14.01 v35.6,18.92 | v27.94,13.97 v13.97,13.97
SPI-CS2  (via drill 0.38)
  Top 0.254: U3.26 19.95,30.97 19.36,31.57 U4.26 18.51,31.5 v17.02,31.5 | v31.24,13.21 v35.56,8.89
  Bottom 0.254: v17.02,31.5 16.51,30.99 16.51,28.45 14.99,26.92 14.99,17.27 15.75,16.51 27.94,16.51 v31.24,13.21 | BL.B3 36.07,8.89 v35.56,8.89
SPI-CS3  (via drill 0.38)
  Top 0.254: U3.8 28.81,30.97 29.41,31.57 U4.8 v34.52,31.57
  Bottom 0.254: AL.B3 57.16,47.11 57.78,46.48 57.78,39.62 56.39,38.23 48.9,38.23 46.23,35.56 41.02,35.56 40.64,35.18 35.1,35.18 34.52,34.59 v34.52,31.57
SPI-CS4  (via drill 0.38)
  Top 0.254: 20.32,35.84 U4.22 | U4.22 20.38,36.66 20.55,36.83 20.55,44.48 19.56,45.47 19.56,52.58 v20.32,53.34 | U4.22 20.38,34.23 21.34,33.27 21.86,33.27 U3.22 | v48.26,53.34 v57.15,53.34
  Bottom 0.254: AH.B3 61.02,19.11 64.77,22.86 64.77,50.8 60.96,54.61 57.15,54.61 v57.15,53.34 | v20.32,53.34 21.59,54.61 35.56,54.61 36.83,53.34 v48.26,53.34
SPI-MISO  (via drill 0.38)
  Top 0.254: U3.11 27.85,32.47 29.36,33.98 U4.11 35.24,33.97 v35.31,34.04 | AL.B0 57.03,54.73 v58.42,53.34 | AH.B0 54.41,26.67 v57.15,26.67 58.42,25.4 71.12,25.4 76.2,20.32 76.2,5.08 73.66,2.54 v48.26,2.54 | v45.21,28.07 48.13,28.07 v49.53,26.67
  Bottom 0.254: AH.B0 53.02,25.4 50.8,25.4 v49.53,26.67 | v58.42,53.34 58.42,27.94 v57.15,26.67 | BL.B0 42.93,2.54 v48.26,2.54 | v45.21,28.07 45.09,27.94 42.93,27.94 41.85,29.02 41.85,29.27 BH.B0 41.59,29.21 39.37,29.21 39.12,29.46 39.12,30.73 35.81,34.04 v35.31,34.04
SPI-MOSI  (via drill 0.38)
  Top 0.254: U3.10 28.19,31.97 29.36,33.15 U4.10 35.71,33.17 v36.83,34.29 | AL.B1 58.3,52.19 v60.96,49.53 | v48.26,5.08 72.39,5.08 74.93,7.62 74.93,19.05 69.85,24.13 54.41,24.13 AH.B1 | v50.04,27.94 48.77,29.21 v46.99,29.21
  Bottom 0.254: v36.83,34.29 39.17,34.29 BH.B1 41.85,31.81 43.18,30.48 45.72,30.48 v46.99,29.21 | v60.96,49.53 60.96,25.4 59.69,24.13 54.41,24.13 AH.B1 54.67,24.19 55.88,25.4 55.88,27.43 55.37,27.94 v50.04,27.94 | BL.B1 41.65,3.93 42.8,5.08 v48.26,5.08
SPI-SCK  (via drill 0.38)
  Top 0.254: U3.9 28.48,31.47 29.38,32.37 U4.9 38.21,32.37 40.19,34.35 BH.B2 | AL.B2 58.3,49.65 v63.5,44.45 | AH.B2 54.41,21.59 69.85,21.59 73.66,17.78 73.66,10.16 71.12,7.62 67.06,7.62 65.79,6.35 v62.99,6.35 | v56.26,29.84 61.59,29.84 v62.23,29.21
  Bottom 0.254: v63.5,44.45 63.5,29.21 | 63.5,29.21 63.5,25.4 59.69,21.59 54.41,21.59 AH.B2 | BL.B2 42.93,7.62 47.5,7.62 50.04,5.08 61.72,5.08 v62.99,6.35 | BH.B2 41.85,34.35 43.18,33.02 55.24,33.02 56.01,32.26 56.01,30.1 v56.26,29.84 | v62.23,29.21 63.5,29.21
UCAP
  Top 0.254: U3.6 U4.6
  Top 0.406: U4.6 33.4,29.97 C11.1
UGND  (via drill 0.61)
  Top 0.254: U4.5 29.4,29.17 29.1,29.47 U3.5
  Top 0.406: v36.7,29.72 C11.2 35.43,29.21 34.72,28.5 33.35,28.5 32.68,29.17 U4.5
  Bottom 0.406: R101.2 37.34,29.08 v36.7,29.72
V_BATT  (via drill 0.38, 0.61)
  Top 0.406: U2.3 12,42.74 11.43,42.16 11.05,42.16 C6.2
  Top 0.61: v11.25,39.98 11.25,40.69 C6.2 | D2.A 3.46,18.7 v4.95,20.19
  Bottom 0.61: v11.25,39.98 7.62,36.35 7.62,36.07 6.86,35.31 3.3,35.31 2.79,34.8 2.79,22.35 4.32,20.83 v4.95,20.19 5.08,20.07 5.08,12.7 13.97,3.81 15.05,3.81 JP4.2
XTAL1
  Top 0.254: U3.17 U4.17
  Top 0.305: U4.17 24.38,38.21 R8.1 25.02,38.86 24.38,39.5 24.38,42.67 24.9,43.19 Y1.1 25.4,43.22 25.4,44.2 25.65,44.45 29.72,44.45 30.1,44.07 C9.1
XTAL2
  Top 0.254: U3.16 24.88,34.61 25.18,34.91 U4.16
  Top 0.305: U4.16 25.18,37.74 R8.2 26.94,39.26 26.94,40.61 Y1.3 27.21,41.02 C7.2

### Text on the board
tPlace: Version 1.1
tNames: 0 | 1 | 2* | 3* | ON | *4 | ^5 | ^6 | CHG | ^7 | 8^ | 9^ | 10^ | 11* | *12 | *13 | (PWM *) | 14 | (Analog ^) | 15
200bmp: D:/Dropbox/GadgetFactory_Engineering/Firefly-Box/AH.bmp | D:/Dropbox/GadgetFactory_Engineering/Firefly-Box/AL.bmp | D:/Dropbox/GadgetFactory_Engineering/Firefly-Box/AL.bmp | D:/Dropbox/GadgetFactory_Engineering/Firefly-Box/BH.bmp | D:/Dropbox/GadgetFactory_Engineering/Firefly-Box/BL.bmp | D:/Dropbox/GadgetFactory_Engineering/Firefly-Box/Bus Text.bmp | D:/Dropbox/GadgetFactory_Engineering/Firefly-Box/DuinoBox.bmp | D:/Dropbox/GadgetFactory_Engineering/Firefly-Box/I2C.bmp | D:/Dropbox/GadgetFactory_Engineering/Firefly-Box/SPI.bmp